# Altium schematic sheet Port L Output Port.SchDoc: Port L Output Port
size 292 x 193 mm; SheetNumber: 5; SheetTotal: 28
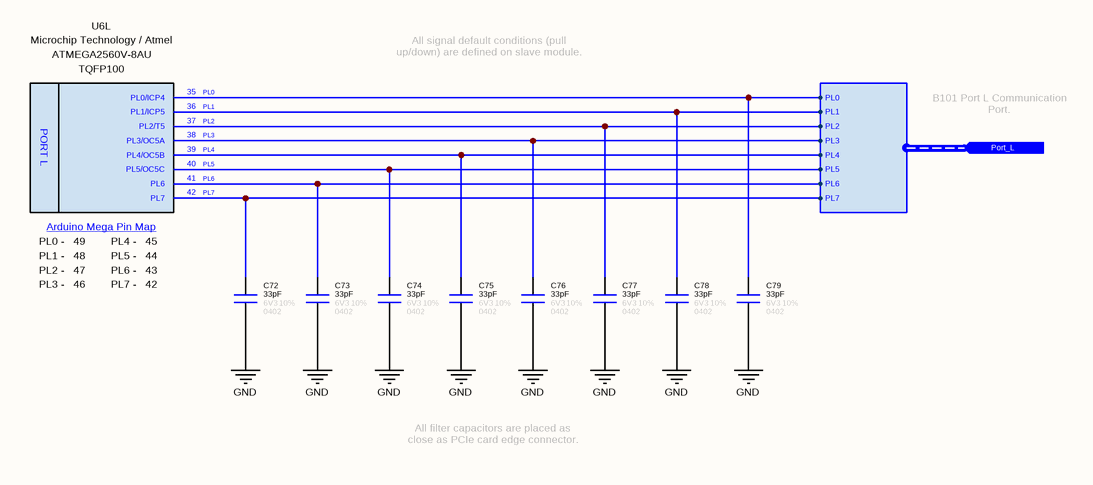
[diagram p0: Port L Output Port.SchDoc]

## Parts
C72  value 33pF  Tolerance: 10%  Case: 0402  Voltage: 6V3  [CAPACITOR_0402]  (hidden comment: Capacitor - 33pF [0402] (Ceramic))
C73  value 33pF  Tolerance: 10%  Case: 0402  Voltage: 6V3  [CAPACITOR_0402]  (hidden comment: Capacitor - 33pF [0402] (Ceramic))
C74  value 33pF  Tolerance: 10%  Case: 0402  Voltage: 6V3  [CAPACITOR_0402]  (hidden comment: Capacitor - 33pF [0402] (Ceramic))
C75  value 33pF  Tolerance: 10%  Case: 0402  Voltage: 6V3  [CAPACITOR_0402]  (hidden comment: Capacitor - 33pF [0402] (Ceramic))
C76  value 33pF  Tolerance: 10%  Case: 0402  Voltage: 6V3  [CAPACITOR_0402]  (hidden comment: Capacitor - 33pF [0402] (Ceramic))
C77  value 33pF  Tolerance: 10%  Case: 0402  Voltage: 6V3  [CAPACITOR_0402]  (hidden comment: Capacitor - 33pF [0402] (Ceramic))
C78  value 33pF  Tolerance: 10%  Case: 0402  Voltage: 6V3  [CAPACITOR_0402]  (hidden comment: Capacitor - 33pF [0402] (Ceramic))
C79  value 33pF  Tolerance: 10%  Case: 0402  Voltage: 6V3  [CAPACITOR_0402]  (hidden comment: Capacitor - 33pF [0402] (Ceramic))
U6  Manufacturer Name: Microchip Technology / Atmel  Case: TQFP100  [TQFP-100]  (hidden comment: ATMEGA2560V-8AU)  (part L of 16)

## Ports
Port_L (in, harness Port_L)

## Harnesses
Port_L: PL3, PL2, PL1, PL0, PL4, PL5, PL6, PL7

## Nets
GND: C72.1 C73.1 C74.1 C75.1 C76.1 C77.1 C78.1 C79.1
PL0: C79.2 U6.35(PL0/ICP4) ; port Port_L.PL0
PL1: C78.2 U6.36(PL1/ICP5) ; port Port_L.PL1
PL2: C77.2 U6.37(PL2/T5) ; port Port_L.PL2
PL3: C76.2 U6.38(PL3/OC5A) ; port Port_L.PL3
PL4: C75.2 U6.39(PL4/OC5B) ; port Port_L.PL4
PL5: C74.2 U6.40(PL5/OC5C) ; port Port_L.PL5
PL6: C73.2 U6.41(PL6) ; port Port_L.PL6
PL7: C72.2 U6.42(PL7) ; port Port_L.PL7

## Notes on the sheet
- All signal default conditions (pull up/down) are defined on slave module.
- B101 Port L Communication Port.
- All filter capacitors are placed as close as PCIe card edge connector.
- © 2021 All rights reserved.
  This document may not, in whole or in part, be copied, photocopied, reproduced, translated or converted to any electronic or machine readable from without prior written permission of Mehmet Günce Akkoyun.
  Engineer contact : akkoyun@me.com
- Property of
- Engineer :
- Date :
- Size :
- A4
- Time :
- Project :
- Page :
- /
- Customer :
- Product ID :
- Module ID :
- Version :
- File :
- Revision :
- (in symbol IC - AtMega2560V-8AU, part L) PORT L; Arduino Mega Pin Map; PL0 -; PL4 -; PL1 -; PL5 -; PL2 -; PL6 -; PL3 -; PL7 -

## Library data of the parts
C72-C79 = Capacitor - 33pF [0402-6V3]: Manufacturer Name: Kemet; Manufacturer Part Number: C0402C330J9RACAUTO; ComponentLink1Description: DataSheet; ComponentLink1URL: https://api.kemet.com/component-edge/download/datasheet/C0402C330J9RACAUTO.pdf; ComponentLink2Description: Mouser; ComponentLink2URL: https://www.mouser.com/Search/Refine.aspx?Keyword=80-C0402C330J9RAUTO
U6 = IC - AtMega2560V-8AU: ATmega Series 256 KB Flash 8 KB SRAM 8 MHz 8-Bit Microcontroller - TQFP-100; Program Memory Size: 256 kB; Core: AVR; Operating Supply Voltage: 2.7 V to 5.5 V; Maximum Clock Frequency: 8 MHz; Maximum Operating Temperature: + 85 C; Product Type: MicroControllers; Minimum Operating Temperature: - 40 C; Manufacturer Part Number: ATMEGA2560V-8AU